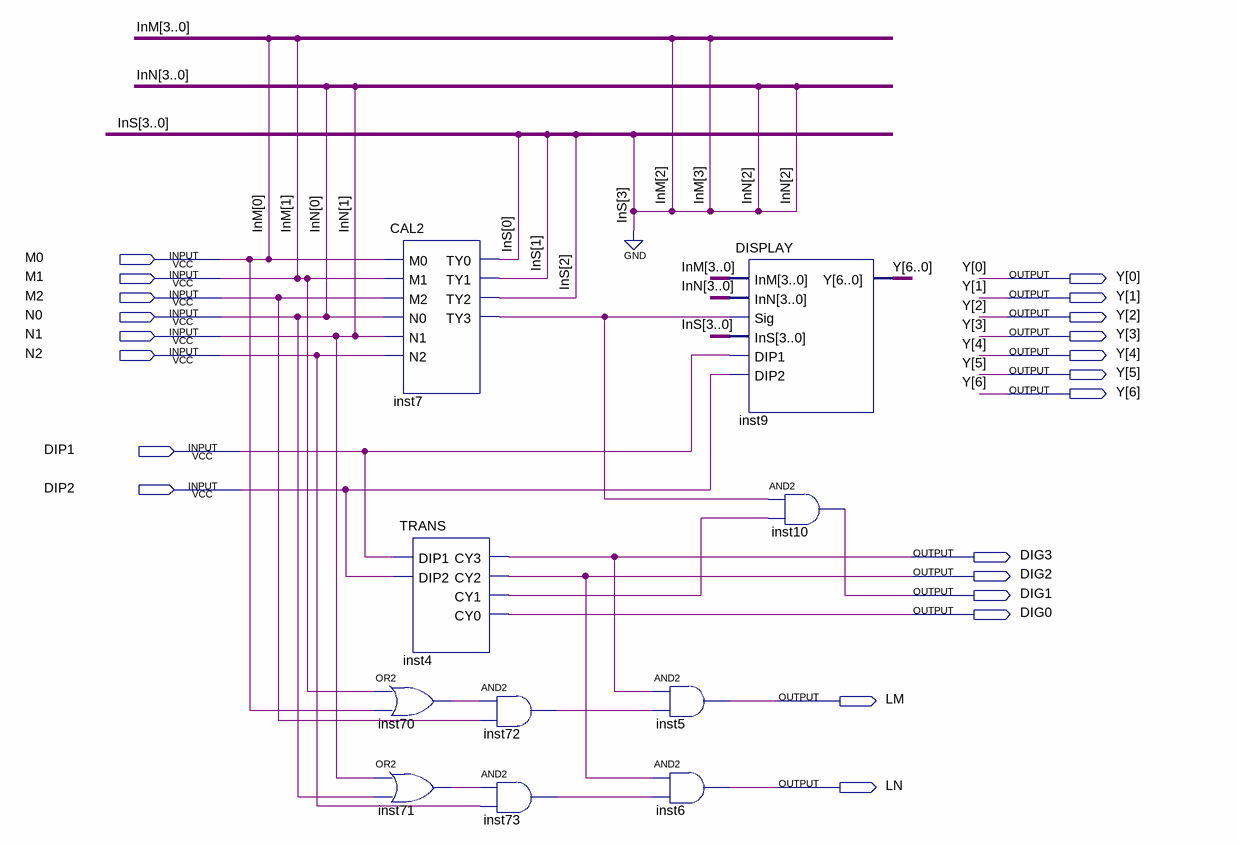
[diagram p0: schematic sheet]
// Quartus schematic FINAL2.bdf as structural Verilog: 10 symbols, 21 pins
module FINAL2 (
  input  M0,
  input  M1,
  input  M2,
  input  N0,
  input  N1,
  input  N2,
  input  DIP1,
  input  DIP2,
  output [6:0] Y,
  output DIG3,
  output DIG2,
  output DIG1,
  output DIG0,
  output LM,
  output LN
);

  wire inst4_cy1, inst7_ty3, inst70_out, inst71_out, inst72_out, inst73_out;
  wire [2:0] InS;
  wire [3:3] InN;

  CAL2 inst7 (
    .M0(M0), .M1(M1), .M2(M2), .N0(N0), .N1(N1), .N2(N2), .TY0(InS[0]), .TY1(InS[1]), .TY2(InS[2]),
    .TY3(inst7_ty3));
  TRANS inst4 (.DIP1(DIP1), .DIP2(DIP2), .CY3(DIG3), .CY2(DIG2), .CY1(inst4_cy1), .CY0(DIG0));
  or inst70 (inst70_out, M1, M0);
  or inst71 (inst71_out, N1, N0);
  and inst72 (inst72_out, inst70_out, M2);
  and inst73 (inst73_out, inst71_out, N2);
  and inst5 (LM, DIG3, inst72_out);
  and inst6 (LN, DIG2, inst73_out);
  DISPLAY inst9 (
    .InM({2'b00, M1, M0}), .InN({InN[3], 1'b0, N1, N0}), .Sig(inst7_ty3), .InS({1'b0, InS}), .DIP1(DIP1),
    .DIP2(DIP2), .Y(Y));
  and inst10 (DIG1, inst7_ty3, inst4_cy1);

  // Other names for the same wires on the sheet: InM[1:0] = {M1, M0}; InN[1:0] = {N1, N0}
endmodule
